# EAGLE schematic VariablePowerSupply (EAGLE 7.4.0)
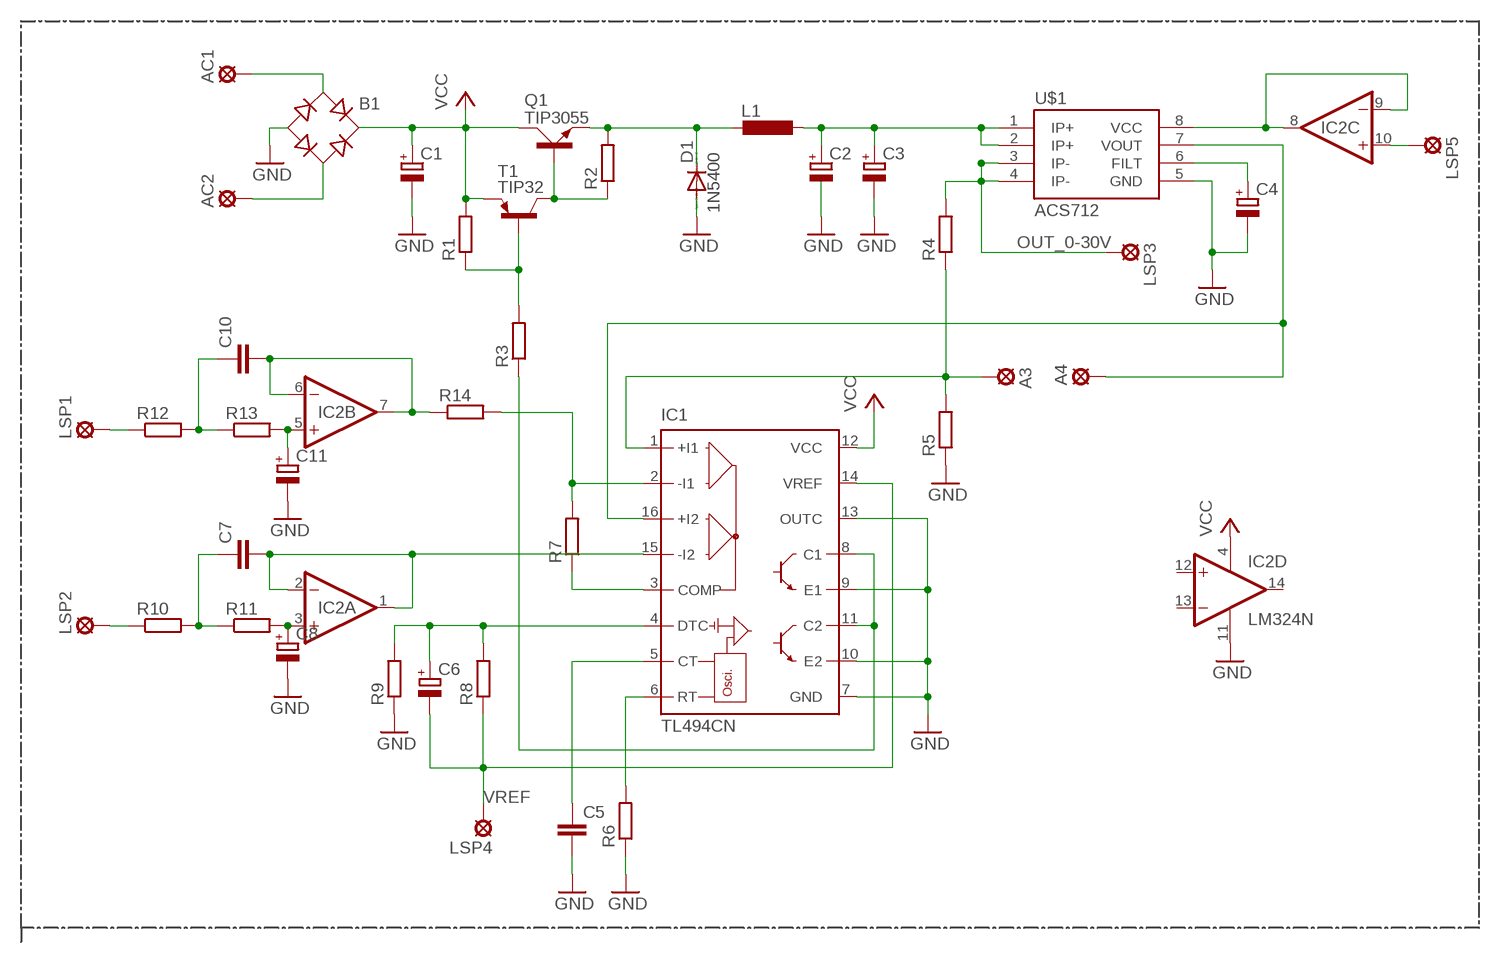
[diagram p0: schematic, sheet 1]

## Parts
A3  LSP10  [LSP10]
A4  LSP10  [LSP10]
AC1  LSP10  [LSP10]
AC2  LSP10  [LSP10]
B1  DBDB101G  [DB]
C1  CPOL-EU085CS-1AR  [085CS_1AR]
C2  CPOL-EU085CS-1AR  [085CS_1AR]
C3  CPOL-EU085CS-1AR  [085CS_1AR]
C4  CPOL-EU085CS-1AR  [085CS_1AR]
C5  C-EU025-025X050  [C025-025X050]
C6  CPOL-EU085CS-1AR  [085CS_1AR]
C7  C-EU025-025X050  [C025-025X050]
C8  CPOL-EU085CS-1AR  [085CS_1AR]
C10  C-EU025-025X050  [C025-025X050]
C11  CPOL-EU085CS-1AR  [085CS_1AR]
D1  1N5400  [DO201-15]
IC1  TL494CN  [DIL16]
IC2  LM324N  [DIL14]
L1  L-EU0207/10  [0207/10]
LSP1  LSP10  [LSP10]
LSP2  LSP10  [LSP10]
LSP3  LSP10  [LSP10]
LSP4  LSP10  [LSP10]
LSP5  LSP10  [LSP10]
Q1  TIP3055  [TOP3AV]
R1  R-EU_0204/5  [0204/5]
R2  R-EU_0204/5  [0204/5]
R3  R-EU_0204/5  [0204/5]
R4  R-EU_0204/5  [0204/5]
R5  R-EU_0204/5  [0204/5]
R6  R-EU_0204/5  [0204/5]
R7  R-EU_0204/5  [0204/5]
R8  R-EU_0204/5  [0204/5]
R9  R-EU_0204/5  [0204/5]
R10  R-EU_0204/5  [0204/5]
R11  R-EU_0204/5  [0204/5]
R12  R-EU_0204/5  [0204/5]
R13  R-EU_0204/5  [0204/5]
R14  R-EU_0204/5  [0204/5]
T1  TIP32  [TO220]
U$1  ACS712  [SO08]

## Nets
GND: B1.- C1.- C2.- C3.- C4.- C5.2 C8.- C11.- D1.A IC1.7(GND) IC1.9(E1) IC1.10(E2) IC1.13(OUTC) IC2.11(P:V-) R5.1 R6.1 R9.1 U$1.5(GND)
N$1: IC1.8(C1) IC1.11(C2) R3.1
N$2: R1.1 R3.2 T1.1(B)
N$3: Q1.B R2.1 T1.2(C)
N$4: C2.+ C3.+ L1.1 U$1.1(IP+) U$1.2(IP+)
N$5: D1.C L1.2 Q1.E R2.2
N$6: C4.+ U$1.6(FILT)
N$7: A4.MP IC1.16(+I2) U$1.7(VOUT)
N$8: IC2.8(C:OUT) IC2.9(C:-IN) U$1.8(VCC)
N$9: A3.MP IC1.1(+I1) R4.1 R5.2
N$10: C5.1 IC1.5(CT)
N$11: IC1.6(RT) R6.2
N$12: IC2.10(C:+IN) LSP5.MP
N$13: IC1.3(COMP) R7.1
N$14: IC1.2(-I1) R7.2 R14.2
N$15: C6.+ IC1.4(DTC) R8.2 R9.2
N$16: C10.2 IC2.6(B:-IN) IC2.7(B:OUT) R14.1
N$17: C7.2 IC1.15(-I2) IC2.1(A:OUT) IC2.2(A:-IN)
N$18: C8.+ IC2.3(A:+IN) R11.2
N$19: C7.1 R10.2 R11.1
N$20: C10.1 R12.2 R13.1
N$21: C11.+ IC2.5(B:+IN) R13.2
N$22: LSP1.MP R12.1
N$23: LSP2.MP R10.1
N$24: AC2.MP B1.AC2
N$25: AC1.MP B1.AC1
OUT_0-30V: LSP3.MP R4.2 U$1.3(IP-) U$1.4(IP-)
VCC: B1.+ C1.+ IC1.12(VCC) IC2.4(P:V+) Q1.C R1.2 T1.3(E)
VREF: C6.- IC1.14(VREF) LSP4.MP R8.1
Unconnected: IC2.12(D:+IN) IC2.13(D:-IN) IC2.14(D:OUT)

## Library data of the parts
A3 A4 AC1 AC2 LSP1-LSP5 = solpad:LSP10: SOLDER PAD drill 1.0 mm, distributor Buerklin, 12H555
B1 = rectifier:DB?*G: Single Phase 1.0 AMP Glass Passivated Bridge Rectifier Taiwan Semiconductor Co.,Ltd. - TSC Source: http://www.taiwansemi.com/TSCbig5/ezcatfiles/cust/img/img/db101g.pdf http://www.ts.com.tw/db/pictures/modules/PDT/PDT060207001/DBLS201G.pdf
C1-C4 C6 C8 C11 = rcl:CPOL-EU: POLARIZED CAPACITOR, European symbol
C5 C7 C10 = rcl:C-EU: CAPACITOR, European symbol
D1 = diode:1N5400: DIODE standard rectifier, 3 A, 50 V (Motorola)
IC1 = linear:TL494*: SWITCHMODE Pulse Width Modulation Control Circuit NCV494B http://onsemi.com tl494-d.pdf
IC2 = linear:LM324: OP AMP
L1 = rcl:L-EU: INDUCTOR, European symbol
Q1 = transistor-power:TIP3055: NPN TRANSISTOR
R1-R14 = rcl:R-EU_: RESISTOR, European symbol
T1 = transistor:TIP32: PNP Transistor Medium Power Linear Switching Applications Source: http://onsemi.com
U$1 = SparkFun-AnalogIC:ACS712: Hall-effect-based isolated linear current sensor; PROD_ID: IC-08964